# EAGLE design USB-HID-Control-Switches-Module (EAGLE 9.6.2)
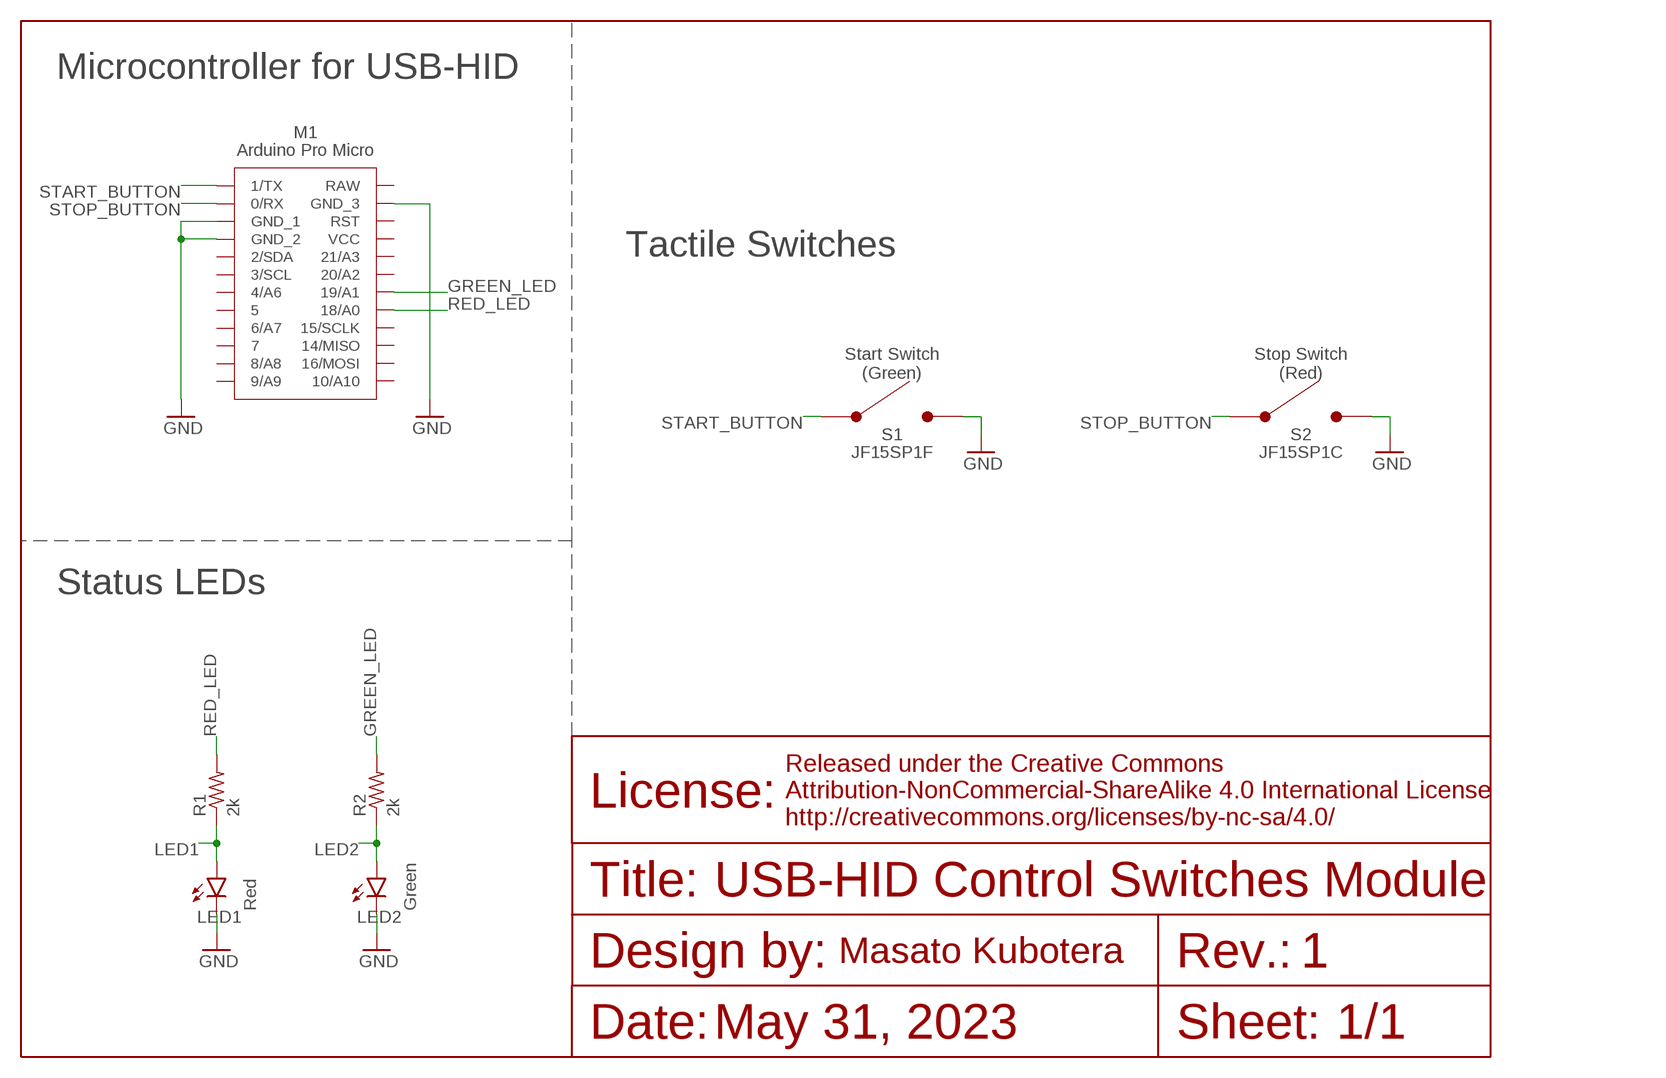
[diagram p0: schematic, sheet 1]

## Parts
LED1  Red  LEDSML0603  [SML0603]
LED2  Green  LEDSML0603  [SML0603]
M1  PRO_MICRO_SMD  [PRO_MICRO_SMD]
R1  2k  R-US_R0603  [R0603]
R2  2k  R-US_R0603  [R0603]
S1  JF15SP1F  [JF15SP1]
S2  JF15SP1C  [JF15SP1]

## Nets
GND: LED1.C LED2.C M1.3(GND_1) M1.4(GND_2) M1.23(GND_3) S1.3 S1.4 S2.3 S2.4
GREEN_LED: M1.18(19/A1) R2.2
LED1: LED1.A R1.1
LED2: LED2.A R2.1
RED_LED: M1.17(18/A0) R1.2
START_BUTTON: M1.1(1/TX) S1.1 S1.2
STOP_BUTTON: M1.2(0/RX) S2.1 S2.2
Unconnected: M1.5(2/SDA) M1.6(3/SCL) M1.7(4/A6) M1.8 M1.9(6/A7) M1.10 M1.11(8/A8) M1.12(9/A9) M1.13(10/A10) M1.14(16/MOSI) M1.15(14/MISO) M1.16(15/SCLK) M1.19(20/A2) M1.20(21/A3) M1.21(VCC) M1.22(RST) M1.24(RAW)

## Notes on the sheet
- Microcontroller for USB-HID
- Tactile Switches
- Start Switch
  (Green)
- Stop Switch
  (Red)
- Status LEDs
- USB-HID Control Switches Module
- 1
- May 31, 2023 | 1/1

## Library data of the parts
LED1 LED2 = led:LED: LED OSRAM: - CHIPLED LG R971, LG N971, LY N971, LG Q971, LY Q971, LO R971, LY R971 LH N974, LH R974 LS Q976, LO Q976, LY Q976 LO Q996 - Hyper CHIPLED LW Q18S LB Q993, LB Q99A, LB R99A - SideLED LS A670, LO A670, LY A670, LG A670, LP A670 LB A673, LV A673, LT A673, LW A673 LH A674 LY A675 LS A676, LA A676, LO A676, LY A676, LW A676 LS A679, LY A679, LG A679 - Hyper Micro SIDELED® LS Y876, LA Y876, LO Y876, LY Y876 LT Y87S - SmartLED LW L88C, LW L88S LB L89C, LB L89S, LG L890 LS L89K, LO L89K, LY L89K LS L896, LA L896, LO L896, LY L896 - TOPLED LS T670, LO T670, LY T670, LG T670, LP T670 LSG T670, LSP T670, LSY T670, LOP T670, LYG T670 LG T671, LOG T671, LSG T671 LB T673, LV T673, LT T673, LW T673 LH T674 LS T676, LA T676, LO T676, LY T676, LB T676, LH T676, LSB T676, LW T676 LB T67C, LV T67C, LT T67C, LS T67K, LO T67K, LY T67K, LW E67C LS E67B, LA E67B, LO E67B, LY E67B, LB E67C, LV E67C, LT E67C LW T67C LS T679, LY T679, LG T679 LS T770, LO T770, LY T770, LG T770, LP T770 LB T773, LV T773, LT T773, LW T773 LH T774 LS E675, LA E675, LY E675, LS T675 LS T776, LA T776, LO T776, LY T776, LB T776 LHGB T686 LT T68C, LB T68C - Hyper Mini TOPLED® LB M676 - Mini TOPLED Santana® LG M470 LS M47K, LO M47K, LY M47K Source: http://www.osram.convergy.de LUXEON: - LUMILED® LXK2-PW12-R00, LXK2-PW12-S00, LXK2-PW14-U00, LXK2-PW14-V00 LXK2-PM12-R00, LXK2-PM12-S00, LXK2-PM14-U00 LXK2-PE12-Q00, LXK2-PE12-R00, LXK2-PE12-S00, LXK2-PE14-T00, LXK2-PE14-U00 LXK2-PB12-K00, LXK2-PB12-L00, LXK2-PB12-M00, LXK2-PB14-N00, LXK2-PB14-P00, LXK2-PB14-Q00 LXK2-PR12-L00, LXK2-PR12-M00, LXK2-PR14-Q00, LXK2-PR14-R00 LXK2-PD12-Q00, LXK2-PD12-R00, LXK2-PD12-S00 LXK2-PH12-R00, LXK2-PH12-S00 LXK2-PL12-P00, LXK2-PL12-Q00, LXK2-PL12-R00 Source: www.luxeon.com KINGBRIGHT: KA-3528ASYC Source: www.kingbright.com
M1 = Arduino:PRO_MICRO_SMD
R1 R2 = rcl:R-US_: RESISTOR, American symbol; SPICEPREFIX: R
S1 = NKK_Switches:JF15SP1F
S2 = NKK_Switches:JF15SP1C

## Net classes
0 default: width 0.127 mm

## Board
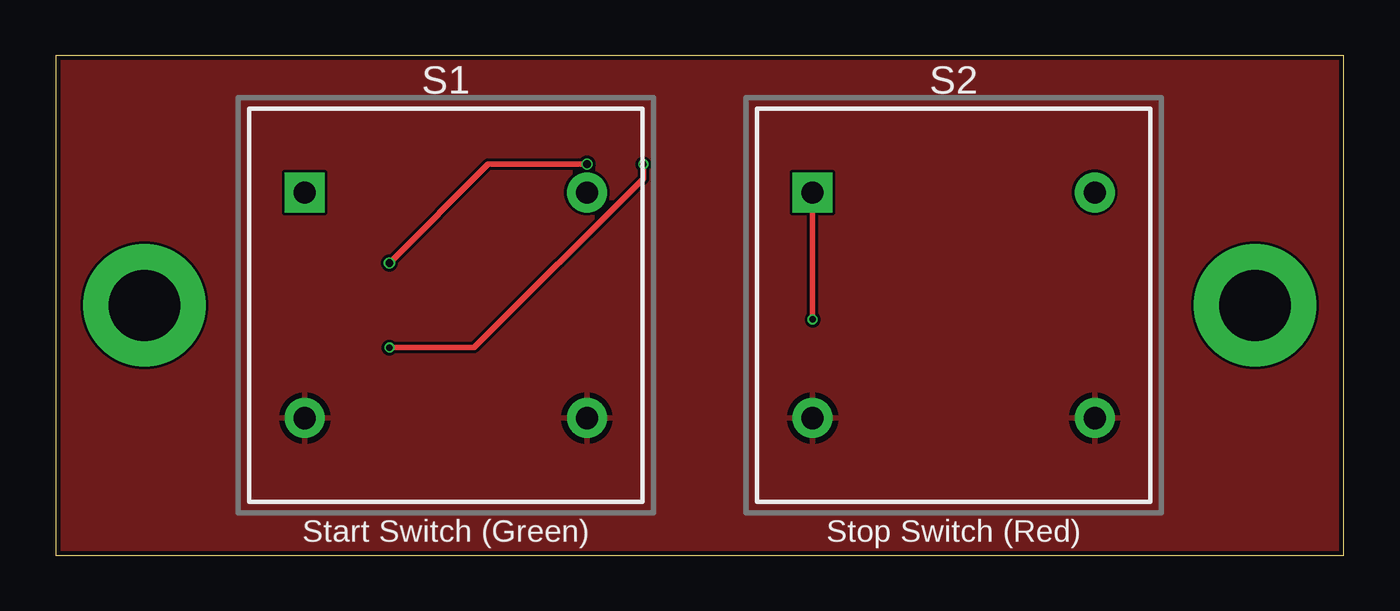
[diagram p1: board, top side]
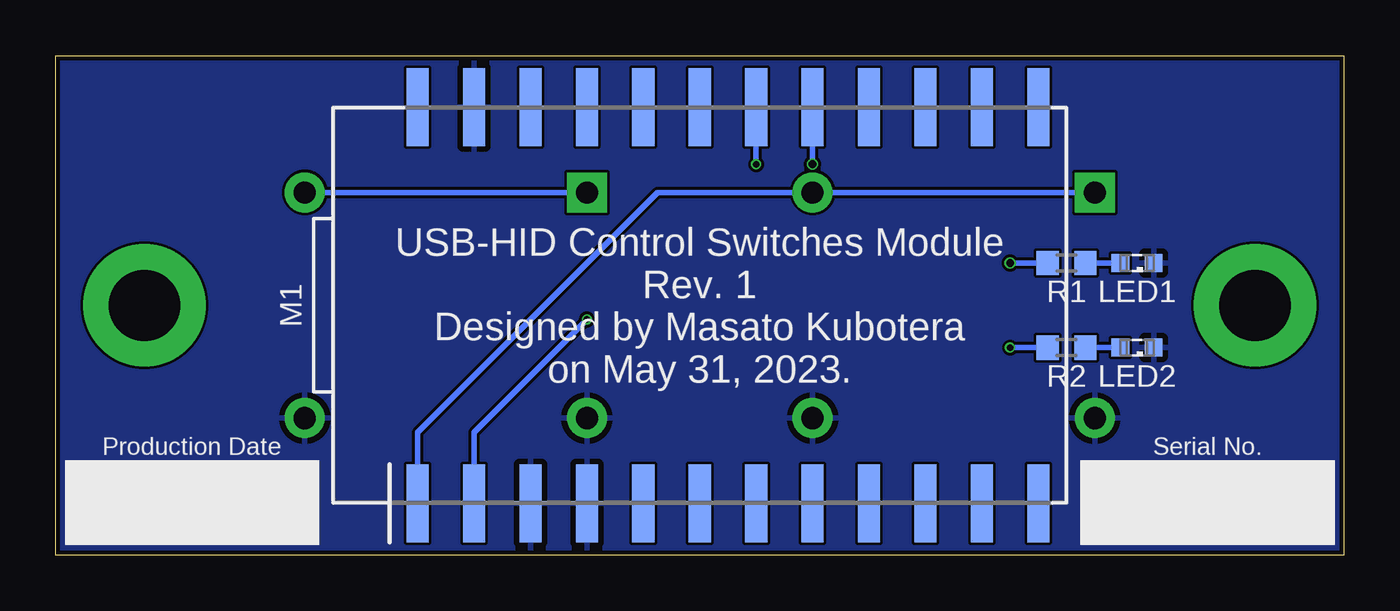
[diagram p2: board, bottom side, seen from below]

Size 58 x 22.5 mm. Coordinates in mm from the lower left corner, seen from the top.
Outline: 0,0 58,0 58,22.5 0,22.5 0,0
Copper layers (1*16): Top 0.035mm / dielectric 1.6mm / Bottom 0.035mm
Design rules "jlcpcb-2layers": minimum track width 5mil, minimum drill 0.3mm, track to track 5mil, track to pad 5mil, pad to pad 5mil, via to via 5mil, smd to smd 5mil, copper to edge 0.2mm, drill to drill 6mil, minimum pad ring 10mil, minimum via ring 3mil, stop-mask expansion 4mil, vias tented up to drill 0mil, thermal gap 10mil

### Footprints (pad centres in the part's own frame; a part is rotated, then mirrored left to right if it is on the bottom)
SML0603 = smd 0.8 x 0.8: A 0.75,0; C -0.75,0
PRO_MICRO_SMD = smd 3.5 x 1: 1 -8.92,13.97; 2 -8.92,11.43; 3 -8.92,8.89; 4 -8.92,6.35; 5 -8.92,3.81; 6 -8.92,1.27; 7 -8.92,-1.27; 8 -8.92,-3.81; 9 -8.92,-6.35; 10 -8.92,-8.89; 11 -8.92,-11.43; 12 -8.92,-13.97; 13 8.92,-13.97; 14 8.92,-11.43; 15 8.92,-8.89; 16 8.92,-6.35; 17 8.92,-3.81; 18 8.92,-1.27; 19 8.92,1.27; 20 8.92,3.81; 21 8.92,6.35; 22 8.92,8.89; 23 8.92,11.43; 24 8.92,13.97
R0603 = smd 1 x 1.1: 1 -0.85,0; 2 0.85,0
JF15SP1 = drill 1 pad 1.778 square: 1 5.08,6.35 | drill 1 pad 1.778: 2 5.08,-6.35; 3 -5.08,6.35; 4 -5.08,-6.35

### Placement (x,y rotation side)
LED1  9.32,13.15 180 bottom
LED2  9.32,9.35 180 bottom
M1  27.73,11.25 90 bottom
R1  12.49,13.15 180 bottom
R2  12.49,9.35 180 bottom
S1  17.57,11.25 90 top
S2  40.43,11.25 90 top

### Tracks (layer width: path | path; a pad name or v marks a point on that pad's centre or on a via)
GND
  Bottom 0.127: 8.55,9.35 LED2.C | 8.55,13.15 LED1.C
  pour Top: -1.48,23.95 -1.48,-1.45 59.48,-1.45 59.48,23.95
  pour Bottom: -2.75,25.22 -2.75,-2.72 60.75,-2.72 60.75,25.22
GREEN_LED  (via drill 0.3)
  Top 0.254: v26.46,17.6 26.46,16.96 18.84,9.35 v15.03,9.35
  Bottom 0.127: 26.46,17.47 v26.46,17.6
  Bottom 0.254: v15.03,9.35 R2.2 | M1.18 v26.46,17.6
LED1
  Bottom 0.254: R1.1 LED1.A
LED2
  Bottom 0.254: R2.1 LED2.A
RED_LED  (via drill 0.35)
  Top 0.152: v23.92,17.61 v23.91,17.6
  Top 0.254: v15.03,13.15 19.48,17.6 v23.91,17.6
  Bottom 0.127: M1.17 23.92,19.63
  Bottom 0.152: v23.92,17.61 v23.92,17.6
  Bottom 0.254: 23.92,19.63 v23.92,17.61 | v15.03,13.15 R1.2
SCREW_HOLE1  (via drill 3.2 pad 5.5)
  other vias: 4,11.25
SCREW_HOLE2  (via drill 3.2 pad 5.5)
  other vias: 54,11.25
START_BUTTON
  Bottom 0.254: S1.1 S1.2 30.91,16.33 41.7,5.54 M1.1
STOP_BUTTON  (via drill 0.3)
  Top 0.254: S2.1 v34.08,10.62
  Bottom 0.254: M1.2 39.16,5.54 v34.08,10.62 | S2.2 S2.1

### Text on the board
tPlace: Start Switch (Green) | Stop Switch (Red)
bPlace: USB-HID Control Switches Module / Rev. 1 / Designed by Masato Kubotera / on May 31, 2023. | Serial No. | Production Date